# Altium project CamBienGiaToc.PrjPcb
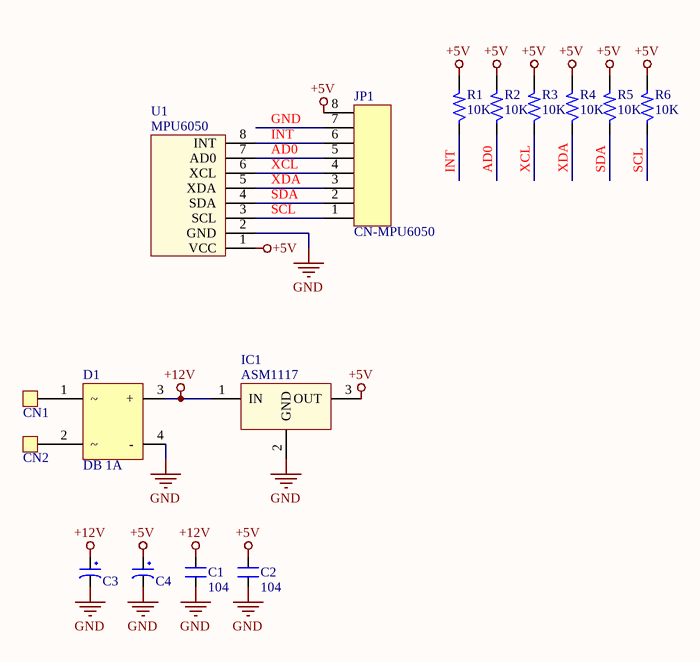
[diagram p0: CamBienGiaToc.SchDoc]
1 sheet, 16 parts. Net scope: global (net labels, ports and power ports of the same name join across sheets).
Board file: CamBienGiaToc.PcbDoc

## Sheet CamBienGiaToc.SchDoc
size A4

### Parts
C1  104  [C-0805]
C2  104  [C-0805]
C3  10uF  [C-TANT-7343-31-CASEA]  (value not drawn)
C4  10uF  [C-TANT-7343-31-CASEA]  (value not drawn)
CN1  COCDONGM3  [M3]  (value not drawn)
CN2  COCDONGM3  [M3]  (value not drawn)
D1  DB 1A  [D-DB-1A-SMD]
IC1  ASM1117  [TO-252]
JP1  CN-MPU6050  [JP8]
R1  10K  [R-0805]
R2  10K  [R-0805]
R3  10K  [R-0805]
R4  10K  [R-0805]
R5  10K  [R-0805]
R6  10K  [R-0805]
U1  MPU6050

### Nets
+5V: C2.2 C4.1 IC1.3(OUT) JP1.8 R1.2 R2.2 R3.2 R4.2 R5.2 R6.2 U1.1(VCC)
+12V: C1.2 C3.1 D1.3(+) IC1.1(IN)
GND: C1.1 C2.1 C3.2 C4.2 D1.4(-) IC1.2(GND) JP1.7 U1.2(GND)
AD0: JP1.5 R2.1 U1.7(AD0)
INT: JP1.6 R1.1 U1.8(INT)
SCL: JP1.1 R6.1 U1.3(SCL)
SDA: JP1.2 R5.1 U1.4(SDA)
XCL: JP1.4 R3.1 U1.6(XCL)
XDA: JP1.3 R4.1 U1.5(XDA)
NetCN1_1: CN1.1 D1.1
NetCN2_1: CN2.1 D1.2

### Library data of the parts
C1 C2 = CN: Value: 0,1uF/300V; Designed by: VanDungEvn
C3 C4 = CP1: Cap P  0,1uF < 22uF , 16 - 50V; Value: 10uF/50V; Description 1: 10 => 220uF/6,3V/10V - 10uF => 100uF/16V; Description 2: 0,1uF => 33uF/50V - 10uF => 22uF/63V; Description 3: 0,47uF => 10uF/100V
CN1 CN2 = COCDONGM3: Value: M3
D1 = DB
IC1 = LM78xx: On ap +, from + 5 to + 24VDC; Value: LM7805
JP1 = JP8: Value: JP8
R1-R6 = R: Resistor 1/4W; Value: R1/4W - 1K
U1 = MPU6050: Value: MPU6050